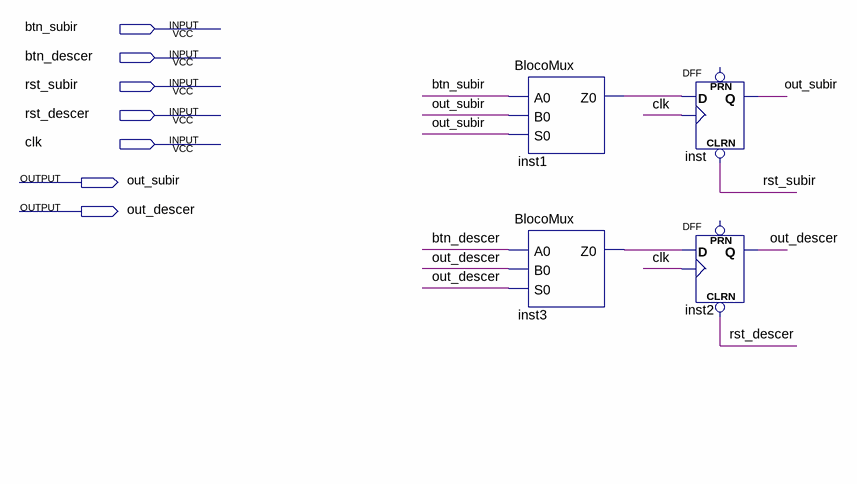
[diagram p0: schematic sheet]
// Quartus schematic registradorBotoes.bdf as structural Verilog: 4 symbols, 7 pins
module registradorBotoes (
  input  btn_subir,
  input  btn_descer,
  input  rst_subir,
  input  rst_descer,
  input  clk,
  output out_subir,
  output out_descer
);

  wire inst1_z0, inst3_z0;

  BlocoMux inst1 (.A0(btn_subir), .B0(out_subir), .S0(out_subir), .Z0(inst1_z0));
  BlocoMux inst3 (.A0(btn_descer), .B0(out_descer), .S0(out_descer), .Z0(inst3_z0));
  DFF inst (.CLRN(rst_subir), .CLK(clk), .D(inst1_z0), .Q(out_subir));  // open: PRN
  DFF inst2 (.CLRN(rst_descer), .CLK(clk), .D(inst3_z0), .Q(out_descer));  // open: PRN
endmodule
